# EAGLE design MK (EAGLE 9.4.2)
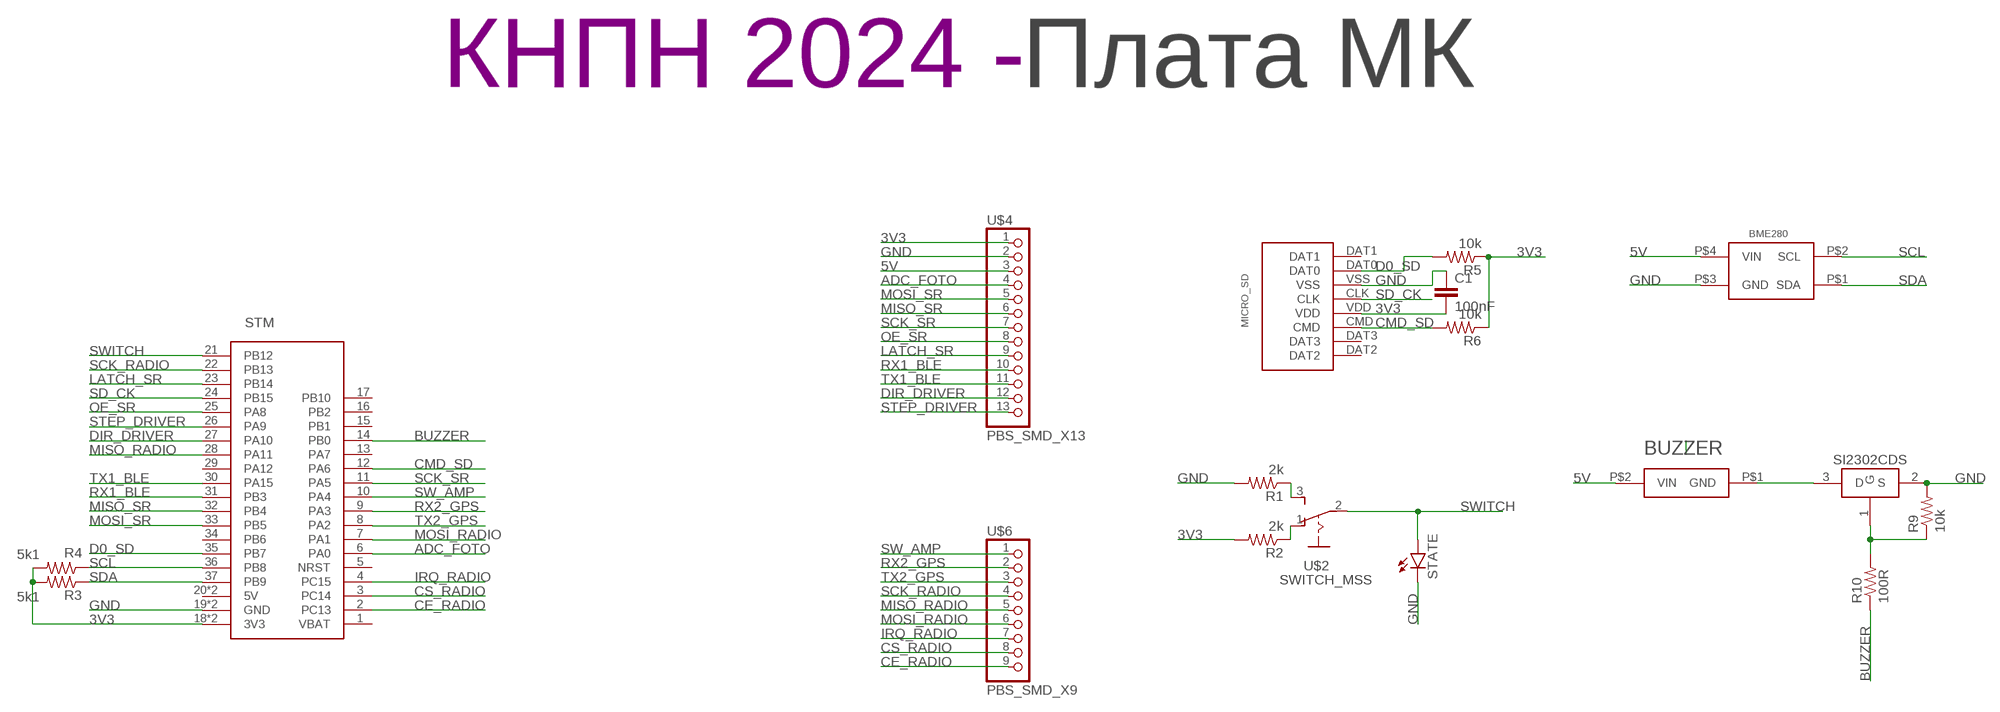
[diagram p0: schematic, sheet 1]

## Parts
BME280  BME280BME280-PINS-ONLY  [BME280-PINS-ONLY]
BUZZER  BUZZERS8R6  [BUZZER-S8R12]
C1  100nF  C-EUC0603  [C0603]
MICRO_SD  SD  [SD]
R1  2k  R-US_R0603  [R0603]
R2  2k  R-US_R0603  [R0603]
R3  5k1  R-US_R0603  [R0603]
R4  5k1  R-US_R0603  [R0603]
R5  10k  R-US_R0603  [R0603]
R6  10k  R-US_R0603  [R0603]
R9  10k  R-US_R0603  [R0603]
R10  100R  R-US_R0603  [R0603]
SI2302CDS  SI2302CDS  [SOT23-3]
STATE  LEDCHIPLED_0603  [CHIPLED_0603]
STM  STM32F411_BOARD  [STM32F411_BOARD]
U$1  Плата МК  LOGOPCB-""  [LOGO]
U$2  SWITCH_MSS  [SWITCH_MSS]
U$4  PBS_SMD_X13  [PBD_SMD_X13]
U$6  PBS_SMD_X9  [PBS_SMD_X9]

## Nets
3V3: C1.2 MICRO_SD.VDD R2.2 R3.2 R4.2 R5.1 R6.1 STM.18(3V3) STM.40(3V3) U$4.1
5V: BME280.P$4(VIN) BUZZER.P$2(VIN) U$4.3
ADC_FOTO: STM.6(PA0) U$4.4
BUZZER: R10.1 STM.14(PB0)
CE_RADIO: STM.2(PC13) U$6.9
CMD_SD: MICRO_SD.CMD R6.2 STM.12(PA6)
CS_RADIO: STM.3(PC14) U$6.8
D0_SD: MICRO_SD.DAT0 R5.2 STM.35(PB7)
DIR_DRIVER: STM.27(PA10) U$4.12
GND: BME280.P$3(GND) C1.1 MICRO_SD.VSS R1.2 R9.2 SI2302CDS.2(S) STATE.C STM.19(GND) STM.39(GND) U$4.2
IRQ_RADIO: STM.4(PC15) U$6.7
LATCH_SR: STM.23(PB14) U$4.9
MISO_RADIO: STM.28(PA11) U$6.5
MISO_SR: STM.32(PB4) U$4.6
MOSI_RADIO: STM.7(PA1) U$6.6
MOSI_SR: STM.33(PB5) U$4.5
N$1: R1.1 U$2.3(S)
N$2: R2.1 U$2.1(O)
N$13: BUZZER.P$1(GND) SI2302CDS.3(D)
N$14: R9.1 R10.2 SI2302CDS.1(G)
OE_SR: STM.25(PA8) U$4.8
RX1_BLE: STM.31(PB3) U$4.10
RX2_GPS: STM.9(PA3) U$6.2
SCK_RADIO: STM.22(PB13) U$6.4
SCK_SR: STM.11(PA5) U$4.7
SCL: BME280.P$2(SCL) R4.1 STM.36(PB8)
SD_CK: MICRO_SD.CLK STM.24(PB15)
SDA: BME280.P$1(SDA) R3.1 STM.37(PB9)
STEP_DRIVER: STM.26(PA9) U$4.13
SW_AMP: STM.10(PA4) U$6.1
SWITCH: STATE.A STM.21(PB12) U$2.2(P)
TX1_BLE: STM.30(PA15) U$4.11
TX2_GPS: STM.8(PA2) U$6.3
Unconnected: MICRO_SD.DAT1 MICRO_SD.DAT2 MICRO_SD.DAT3 STM.1(VBAT) STM.5(NRST) STM.13(PA7) STM.15(PB1) STM.16(PB2) STM.17(PB10) STM.20(5V) STM.29(PA12) STM.34(PB6) STM.38(5V)

## Library data of the parts
BME280 = UNKNOWN-2024:BME280
BUZZER = CanCubeSat:BUZZER
C1 = rcl:C-EU: CAPACITOR, European symbol; SPICEPREFIX: C
MICRO_SD = UNKNOWN-2024:SD
R1-R6 R9 R10 = rcl:R-US_: RESISTOR, American symbol; SPICEPREFIX: R
SI2302CDS = CanCubeSat:SI2302CDS
STATE = led:LED: LED OSRAM: - CHIPLED LG R971, LG N971, LY N971, LG Q971, LY Q971, LO R971, LY R971 LH N974, LH R974 LS Q976, LO Q976, LY Q976 LO Q996 - Hyper CHIPLED LW Q18S LB Q993, LB Q99A, LB R99A - SideLED LS A670, LO A670, LY A670, LG A670, LP A670 LB A673, LV A673, LT A673, LW A673 LH A674 LY A675 LS A676, LA A676, LO A676, LY A676, LW A676 LS A679, LY A679, LG A679 - Hyper Micro SIDELED® LS Y876, LA Y876, LO Y876, LY Y876 LT Y87S - SmartLED LW L88C, LW L88S LB L89C, LB L89S, LG L890 LS L89K, LO L89K, LY L89K LS L896, LA L896, LO L896, LY L896 - TOPLED LS T670, LO T670, LY T670, LG T670, LP T670 LSG T670, LSP T670, LSY T670, LOP T670, LYG T670 LG T671, LOG T671, LSG T671 LB T673, LV T673, LT T673, LW T673 LH T674 LS T676, LA T676, LO T676, LY T676, LB T676, LH T676, LSB T676, LW T676 LB T67C, LV T67C, LT T67C, LS T67K, LO T67K, LY T67K, LW E67C LS E67B, LA E67B, LO E67B, LY E67B, LB E67C, LV E67C, LT E67C LW T67C LS T679, LY T679, LG T679 LS T770, LO T770, LY T770, LG T770, LP T770 LB T773, LV T773, LT T773, LW T773 LH T774 LS E675, LA E675, LY E675, LS T675 LS T776, LA T776, LO T776, LY T776, LB T776 LHGB T686 LT T68C, LB T68C - Hyper Mini TOPLED® LB M676 - Mini TOPLED Santana® LG M470 LS M47K, LO M47K, LY M47K Source: http://www.osram.convergy.de LUXEON: - LUMILED® LXK2-PW12-R00, LXK2-PW12-S00, LXK2-PW14-U00, LXK2-PW14-V00 LXK2-PM12-R00, LXK2-PM12-S00, LXK2-PM14-U00 LXK2-PE12-Q00, LXK2-PE12-R00, LXK2-PE12-S00, LXK2-PE14-T00, LXK2-PE14-U00 LXK2-PB12-K00, LXK2-PB12-L00, LXK2-PB12-M00, LXK2-PB14-N00, LXK2-PB14-P00, LXK2-PB14-Q00 LXK2-PR12-L00, LXK2-PR12-M00, LXK2-PR14-Q00, LXK2-PR14-R00 LXK2-PD12-Q00, LXK2-PD12-R00, LXK2-PD12-S00 LXK2-PH12-R00, LXK2-PH12-S00 LXK2-PL12-P00, LXK2-PL12-Q00, LXK2-PL12-R00 Source: www.luxeon.com KINGBRIGHT: KA-3528ASYC Source: www.kingbright.com
STM = UNKNOWN-2024:STM32F411_BOARD
U$1 = UNKNOWN-2024:LOGO
U$2 = UNKNOWN-2024:SWITCH_MSS
U$4 = UNKNOWN-2024:PBS_SMD_X13
U$6 = UNKNOWN-2024:PBS_SMD_X9

## Board
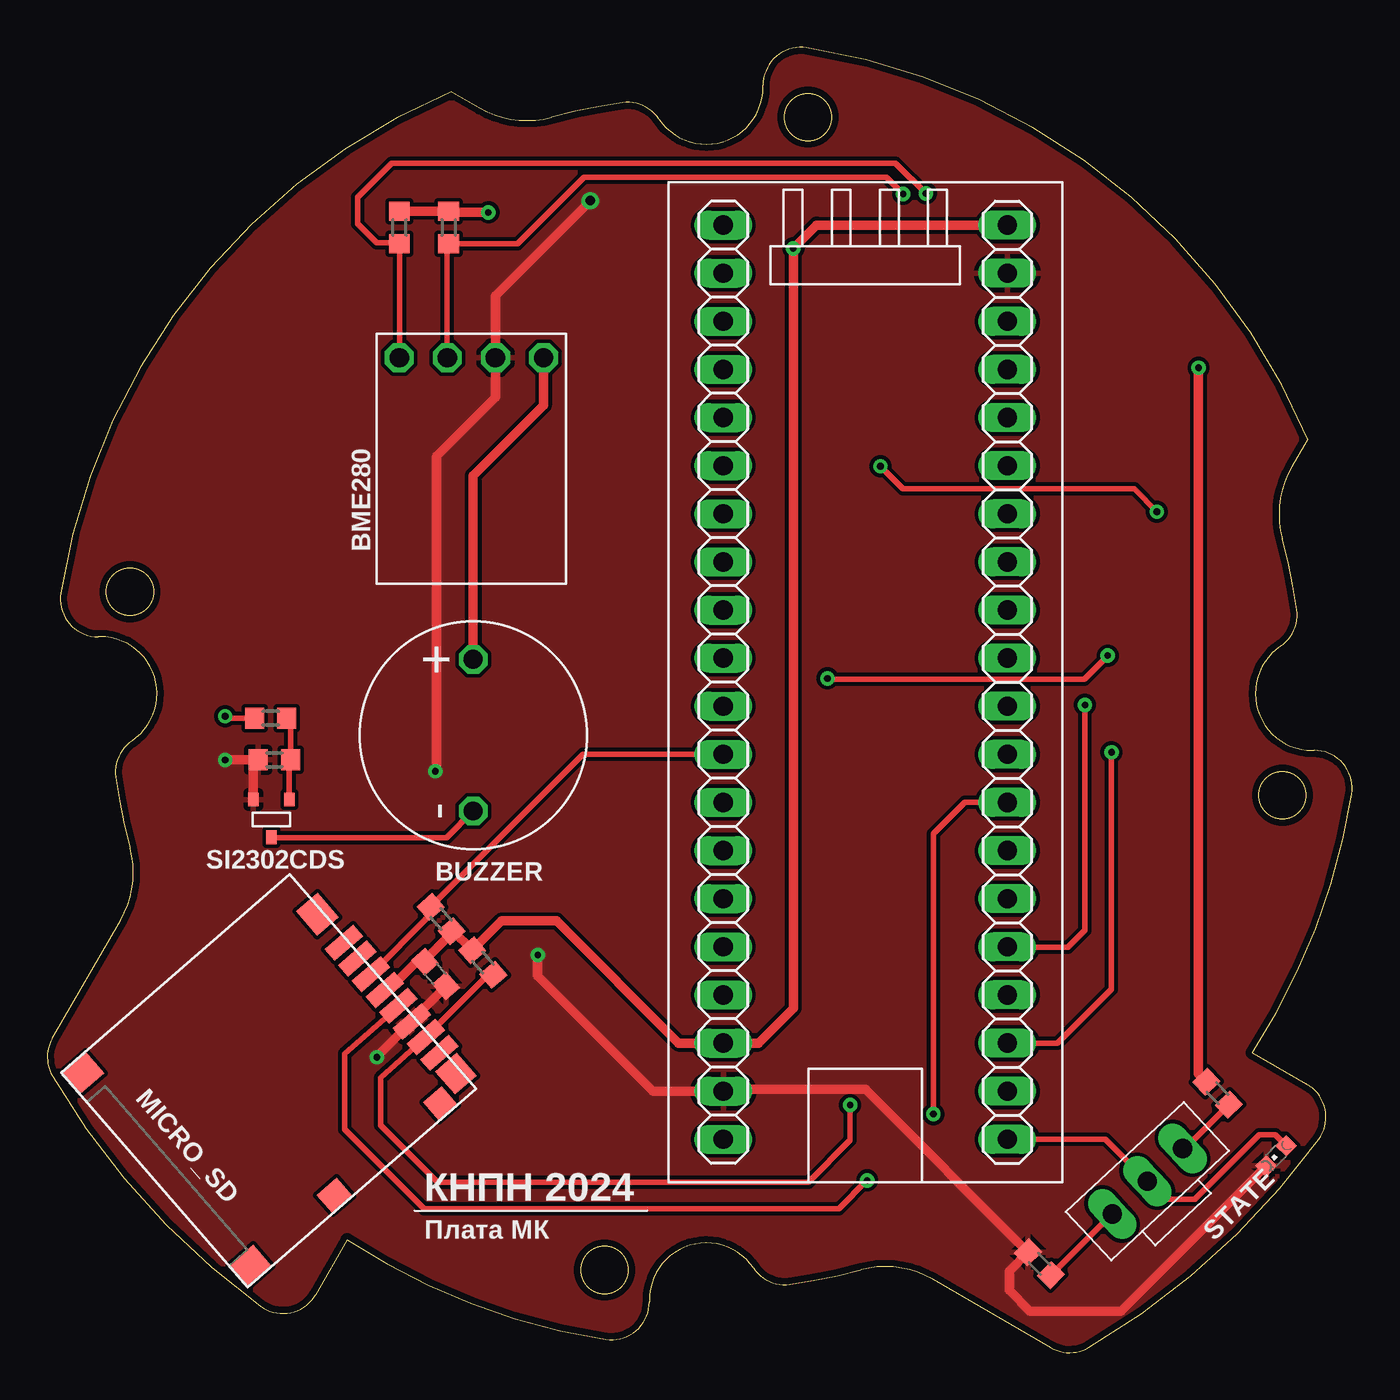
[diagram p1: board, top side]
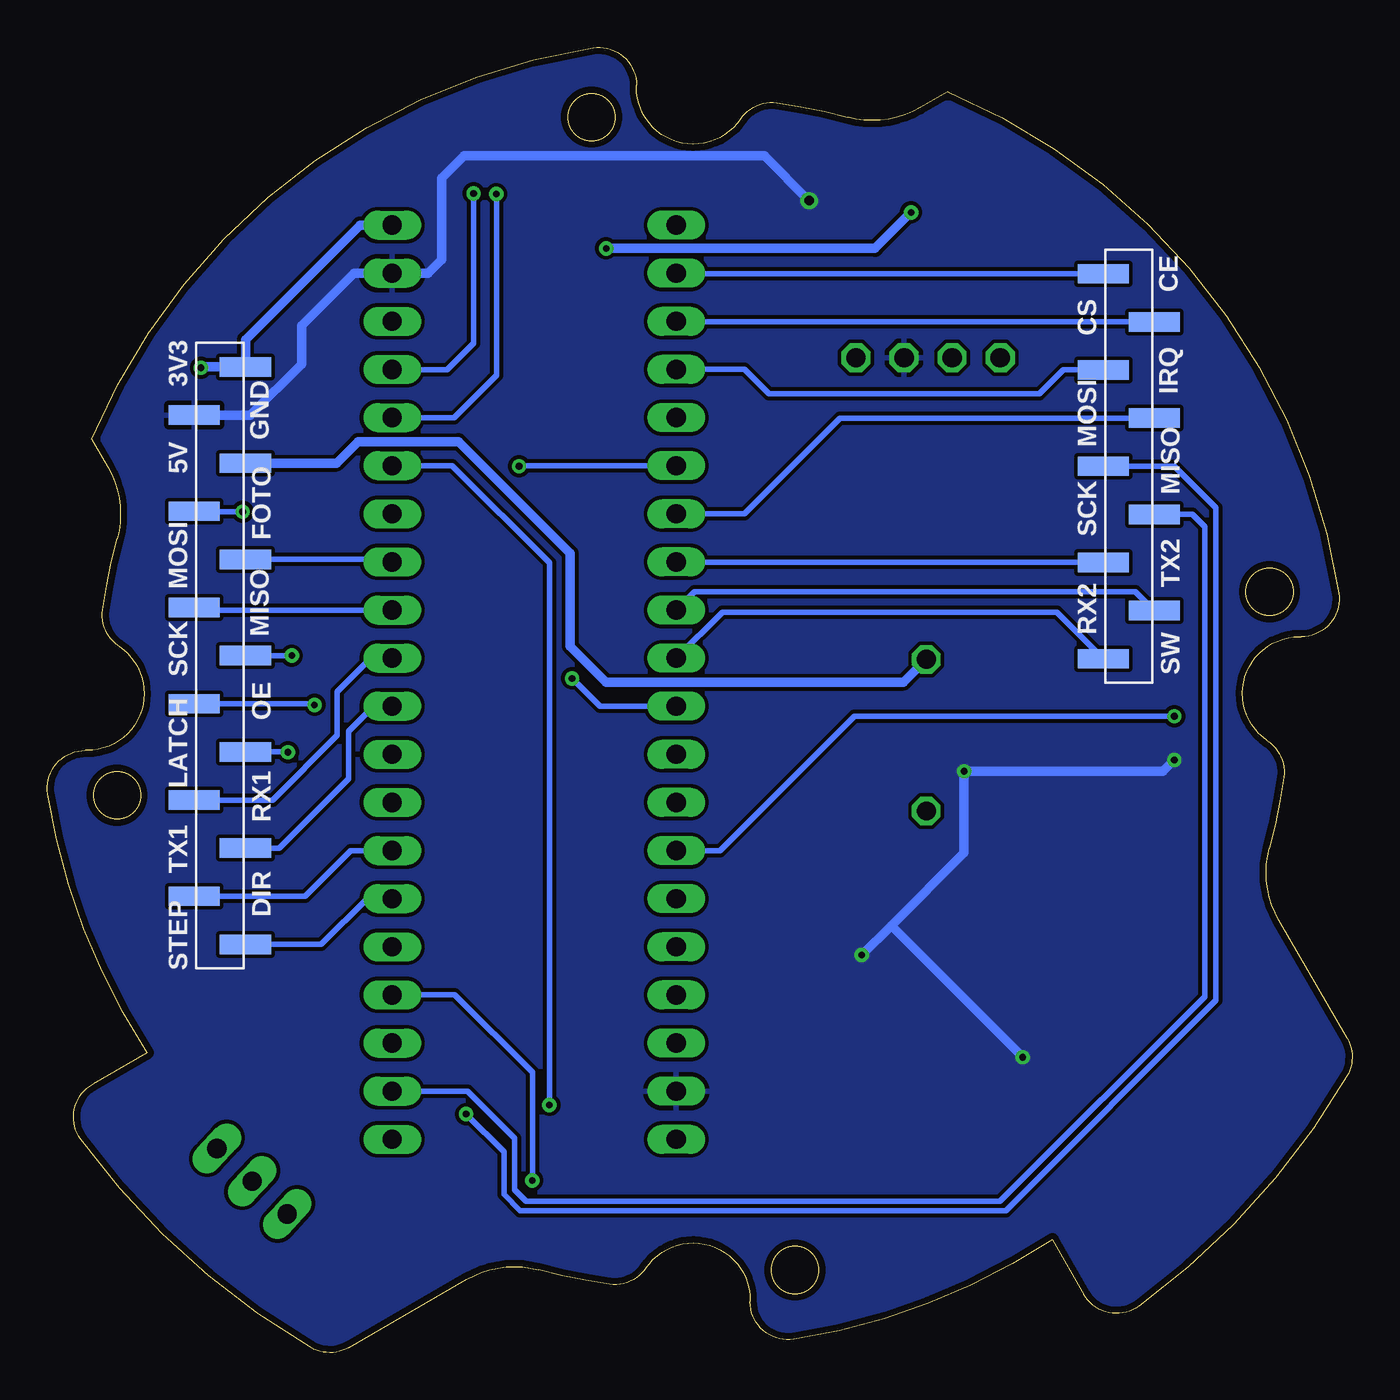
[diagram p2: board, bottom side, seen from below]

Size 68.9 x 68.9 mm. Coordinates in mm from the lower left corner, seen from the top.
Outline: 0.27,16.59 3.87,22.83 arc45 4.37,26.63 arc-7 3.61,30.37 arc-64 4.47,32.31 arc146 2.79,37.79 2.68,37.79 arc-99 0.7,40.1 arc-58 21.36,66.57 22.83,65.72 arc45 26.63,65.22 arc-7 30.37,65.98 arc-64 32.31,65.12 arc146 37.79,66.79 37.79,66.91 arc-99 40.1,68.88 arc-58 66.57,48.23 65.72,46.75 arc45 65.22,42.96 arc-7 65.98,39.22 arc-64 65.12,37.28 arc146 66.79,31.79 66.91,31.79 arc-99 68.88,29.49 arc-24 63.62,15.84 66.52,14.17 arc-96 67.14,11.26 arc-24 55,0.27 arc-60 52.99,0.27 46.75,3.87 arc45 42.96,4.37 arc-7 39.22,3.61 arc-64 37.28,4.47 arc146 31.79,2.79 31.79,2.68 arc-99 29.49,0.7 arc-24 15.84,5.97 14.17,3.07 arc-96 11.26,2.45 arc-24 0.27,14.58 arc-60 0.27,16.59
Outline: circle at 65.22,29.43 radius 1.25
Outline: circle at 29.43,4.36 radius 1.25
Outline: circle at 4.36,40.16 radius 1.25
Outline: circle at 40.16,65.22 radius 1.25
Copper layers (1*16): Top 0.035mm / dielectric 1.5mm / Bottom 0.035mm
Design rules "default *": minimum track width 0.3mm, minimum drill 0.35mm, track to track 0.2mm, track to pad 0.2mm, pad to pad 0.2mm, via to via 0.2mm, smd to smd 0.2mm, copper to edge 0.35mm, drill to drill 0.2mm, minimum pad ring 10mil, minimum via ring 8mil, stop-mask expansion 4mil, vias tented up to drill 0mil, thermal gap 10mil

### Footprints (pad centres in the part's own frame; a part is rotated, then mirrored left to right if it is on the bottom)
BME280-PINS-ONLY = drill 1.016 octagon: P$1 -3.81,5.33; P$2 -1.27,5.33; P$3 1.27,5.33; P$4 3.81,5.33
BUZZER-S8R12 = drill 1 octagon: P$1 -4,0; P$2 4,0
C0603 = smd 1.1 x 1: 1 -0.85,0; 2 0.85,0
SD = smd 0.8 x 2: CLK 6,-15.77; CMD 8.2,-15.77; DAT0 3.8,-15.77; DAT1 2.7,-15.77; DAT2 10.4,-15.77; DAT3 9.3,-15.77; VDD 7.1,-15.77; VSS 4.9,-15.77 | smd 1.5 x 1.7: P$9 0.75,-0.85; P$13 14.25,-0.85 | smd 1.6 x 1.5: P$10 1.3,-15.7 | smd 1.29 x 1.3: P$11 0.645,-14.05 | smd 1.29 x 1.4: P$12 0.645,-6.65 | smd 1.7 x 1.5: P$14 12.45,-15.7
R0603 = smd 1 x 1.1: 1 -0.85,0; 2 0.85,0
SOT23-3 = smd 0.56 x 0.73: 1 -0.95,-1; 2 0.95,-1; 3 0,1
CHIPLED_0603 = smd 0.8 x 0.8: A 0,-0.75; C 0,0.75
STM32F411_BOARD = drill 1.016 long: 1 24.13,7.5; 2 21.59,7.5; 3 19.05,7.5; 4 16.51,7.5; 5 13.97,7.5; 6 11.43,7.5; 7 8.89,7.5; 8 6.35,7.5; 9 3.81,7.5; 10 1.27,7.5; 11 -1.27,7.5; 12 -3.81,7.5; 13 -6.35,7.5; 14 -8.89,7.5; 15 -11.43,7.5; 16 -13.97,7.5; 17 -16.51,7.5; 18 -19.05,7.5; 19 -21.59,7.5; 20 -24.13,7.5; 21 -24.13,-7.5; 22 -21.59,-7.5; 23 -19.05,-7.5; 24 -16.51,-7.5; 25 -13.97,-7.5; 26 -11.43,-7.5; 27 -8.89,-7.5; 28 -6.35,-7.5; 29 -3.81,-7.5; 30 -1.27,-7.5; 31 1.27,-7.5; 32 3.81,-7.5; 33 6.35,-7.5; 34 8.89,-7.5; 35 11.43,-7.5; 36 13.97,-7.5; 37 16.51,-7.5; 38 19.05,-7.5; 39 21.59,-7.5; 40 24.13,-7.5
SWITCH_MSS = drill 1.016 long: 1 -2.54,0; 2 0,0; 3 2.54,0
PBD_SMD_X13 = smd 1.02 x 2.7: 1 -15.24,1.35; 2 -12.7,-1.35; 3 -10.16,1.35; 4 -7.62,-1.35; 5 -5.08,1.35; 6 -2.54,-1.35; 7 0,1.35; 8 2.54,-1.35; 9 5.08,1.35; 10 7.62,-1.35; 11 10.16,1.35; 12 12.7,-1.35; 13 15.24,1.35
PBS_SMD_X9 = smd 1.02 x 2.7: 1 -10.16,1.35; 2 -7.62,-1.35; 3 -5.08,1.35; 4 -2.54,-1.35; 5 0,1.35; 6 2.54,-1.35; 7 5.08,1.35; 8 7.62,-1.35; 9 10.16,1.35

### Placement (x,y rotation side)
BME280  22.39,47.19 0 top
BUZZER  22.49,32.59 90 top
C1  20.49,19.99 131 top
MICRO_SD  10.57,3.44 131 top
R1  52.39,4.69 135 top
R2  61.79,13.69 134 top
R3  18.59,59.39 90 top
R4  21.19,59.39 90 top
R5  22.99,20.59 311 top
R6  20.79,22.89 131 top
R9  11.99,31.29 180 top
R10  11.79,33.49 0 top
SI2302CDS  11.83,28.2 180 top
STATE  64.89,10.39 135 top
STM  43.19,35.39 90 top
U$1  19.39,7.49 0 top
U$2  58.09,9.05 223 top
U$4  59.79,36.79 270 bottom
U$6  11.79,46.79 90 bottom

### Tracks (layer width: path | path; a pad name or v marks a point on that pad's centre or on a via)
3V3  (via drill 0.35)
  Top 0.5: v60.79,51.99 60.79,14.71 R2.2 | R3.2 R4.2 21.24,60.19 v23.29,60.19 | MICRO_SD.VDD 18.02,19.15 19.5,20.64 C1.2 19.94,20.73 21.49,22.29 R6.1 21.44,22.25 22.39,21.29 R5.1 23.99,22.79 26.89,22.79 33.34,16.34 STM.18 37.54,16.34 39.39,18.19 v39.39,58.29 40.62,59.52 STM.40
  Bottom 0.5: v60.79,51.99 60.75,52.03 U$4.1 58.44,53.47 52.39,59.52 STM.40 | v39.39,58.29 25.19,58.29 v23.29,60.19
5V
  Top 0.5: BME280.P$4 26.2,50 22.49,46.29 BUZZER.P$2
  Bottom 0.5: U$4.3 53.63,46.95 52.49,48.09 47.19,48.09 41.29,42.19 41.29,37.29 39.39,35.39 23.69,35.39 BUZZER.P$2
ADC_FOTO  (via drill 0.35)
  Top 0.3: v43.99,46.79 45.19,45.59 57.39,45.59 v58.59,44.39
  Bottom 0.3: STM.6 43.96,46.82 v43.99,46.79 | v58.59,44.39 61.12,44.39 U$4.4
BUZZER  (via drill 0.35)
  Top 0.3: R10.1 9.49,33.49 v9.39,33.59
  Bottom 0.3: v9.39,33.59 26.29,33.59 33.39,26.49 STM.14
CE_RADIO
  Bottom 0.3: U$6.9 35.66,56.95 STM.2
CMD_SD
  Top 0.3: STM.12 28.28,31.58 R6.2 20.19,23.08 MICRO_SD.CMD
CS_RADIO
  Bottom 0.3: U$6.8 35.66,54.41 STM.3
D0_SD  (via drill 0.35)
  Top 0.3: v42.39,13.08 42.39,11.2 40.19,8.99 20.6,8.99 17.59,12 17.59,14.51 19.92,16.6 MICRO_SD.DAT0 23.31,19.99 R5.2
  Bottom 0.3: v42.39,13.08 42.39,41.69 47.52,46.82 STM.35
DIR_DRIVER
  Bottom 0.3: STM.27 52.88,26.5 55.29,24.09 U$4.12
GND  (via drill 0.35, 0.5)
  Top 0.5: R9.2 10.79,31.29 | 10.79,31.29 v9.39,31.29 | v20.49,30.69 20.56,30.76 20.56,47.32 23.66,50.42 BME280.P$3 23.66,55.81 v28.67,60.81 | v25.89,20.99 25.89,19.89 31.98,13.8 STM.19 35.79,13.9 43.21,13.9 R1.2 50.79,4.3 50.79,3.29 51.89,2.19 56.69,2.19 STATE.C | SI2302CDS.2 10.88,31.21 10.79,31.29 | v17.39,15.59 17.39,15.62 MICRO_SD.VSS 19.26,17.56 C1.1
  Bottom 0.5: U$4.2 61.12,49.47 58.2,49.47 55.49,52.19 55.49,54.2 52.7,56.98 STM.39 48.8,56.98 48.09,57.69 48.09,61.99 46.91,63.18 31.04,63.18 v28.67,60.81 | v25.89,20.99 24.34,22.54 | 24.34,22.54 20.49,26.39 v20.49,30.69 9.99,30.69 v9.39,31.29 | v17.39,15.59 24.34,22.54
  pour Bottom: 18.79,69.39 50.39,69.39 70.09,49.69 70.09,10.89 57.99,-1.21 12.29,-1.21 -0.81,11.89 -0.81,49.79
  pour Top: -1.51,49.89 18.69,70.09 50.59,70.09 70.89,49.79 70.89,10.69 58.29,-1.91 11.99,-1.91 -1.51,11.59
IRQ_RADIO
  Bottom 0.3: U$6.7 15.26,51.87 16.52,50.61 30.8,50.61 32.09,51.9 STM.4
LATCH_SR  (via drill 0.35)
  Top 0.3: v56.19,31.69 56.19,19.19 53.34,16.34 STM.23
  Bottom 0.3: U$4.9 56.21,31.71 v56.19,31.69
MISO_RADIO  (via drill 0.35)
  Top 0.3: v46.79,12.59 46.79,27.39 48.44,29.04 STM.28
  Bottom 0.3: U$6.5 9.39,46.79 7.19,44.59 7.19,18.59 18.29,7.49 43.93,7.49 44.79,8.36 44.79,10.59 v46.79,12.59
MISO_SR
  Bottom 0.3: STM.32 61.01,39.2 U$4.6
MOSI_RADIO
  Bottom 0.3: U$6.6 27.05,49.33 32.1,44.28 STM.7
MOSI_SR
  Bottom 0.3: U$4.5 50.82,41.87 STM.33
N$1
  Top 0.3: U$2.3 56.22,7.32 R1.1
N$2
  Top 0.3: U$2.1 60.09,10.78 R2.1
N$13
  Top 0.3: SI2302CDS.3 21.09,27.19 BUZZER.P$1
N$14
  Top 0.3: SI2302CDS.1 12.78,31.23 R9.1 12.84,33.29 R10.2
OE_SR  (via drill 0.35)
  Top 0.3: v54.79,34.19 54.79,22.29 53.89,21.39 50.72,21.39 STM.25
  Bottom 0.3: U$4.8 54.85,34.25 v54.79,34.19
RX1_BLE
  Bottom 0.3: U$4.10 57.01,29.17 53.59,32.59 53.59,34.89 51.82,36.66 STM.31
RX2_GPS
  Bottom 0.3: U$6.2 11.44,40.17 34.72,40.17 STM.9
SCK_RADIO
  Bottom 0.3: U$6.4 8.45,44.25 7.79,43.59 7.79,18.79 18.59,7.99 43.62,7.99 44.22,8.59 44.22,11.32 46.7,13.8 STM.22
SCK_SR  (via drill 0.35)
  Top 0.3: v41.19,35.59 41.24,35.55 54.75,35.55 v55.99,36.79
  Bottom 0.3: STM.11 39.72,34.12 v41.19,35.59 | v55.99,36.79 U$4.7
SCL  (via drill 0.35)
  Top 0.3: v45.19,61.17 44.32,62.04 28.34,62.04 24.84,58.54 R4.1 21.12,58.47 BME280.P$2
  Bottom 0.3: v45.19,61.17 45.19,51.59 47.42,49.36 STM.36
SD_CK  (via drill 0.35)
  Top 0.3: MICRO_SD.CLK 18.23,18.01 15.69,15.79 15.69,11.79 19.89,7.59 41.79,7.59 v43.29,9.09
  Bottom 0.3: v43.29,9.09 43.29,14.79 47.39,18.89 STM.24
SDA  (via drill 0.35)
  Top 0.3: v46.39,61.19 44.79,62.79 18.19,62.79 16.39,60.99 16.39,59.59 17.39,58.59 18.54,58.59 R3.1 BME280.P$1
  Bottom 0.3: v46.39,61.19 46.39,53.29 47.79,51.89 STM.37
STEP_DRIVER
  Bottom 0.3: STM.26 52.02,23.96 54.43,21.55 U$4.13
SW_AMP
  Bottom 0.3: U$6.1 15.6,39.09 33.26,39.09 STM.10
SWITCH
  Top 0.3: STATE.A 64.85,11.49 63.99,11.49 60.59,8.09 59.05,8.09 U$2.2 55.88,11.26 STM.21
TX1_BLE
  Bottom 0.3: U$4.11 56.65,26.63 52.99,30.29 52.99,32.79 51.66,34.12 STM.30
TX2_GPS
  Bottom 0.3: U$6.3 35.66,41.71 STM.8

### Text on the board
bNames: CE | CS | IRQ | 3V3 | MOSI | GND | 5V | MISO | SCK | FOTO | TX2 | MOSI | RX2 | MISO | SW | SCK | OE | LATCH | RX1 | TX1 | DIR | STEP